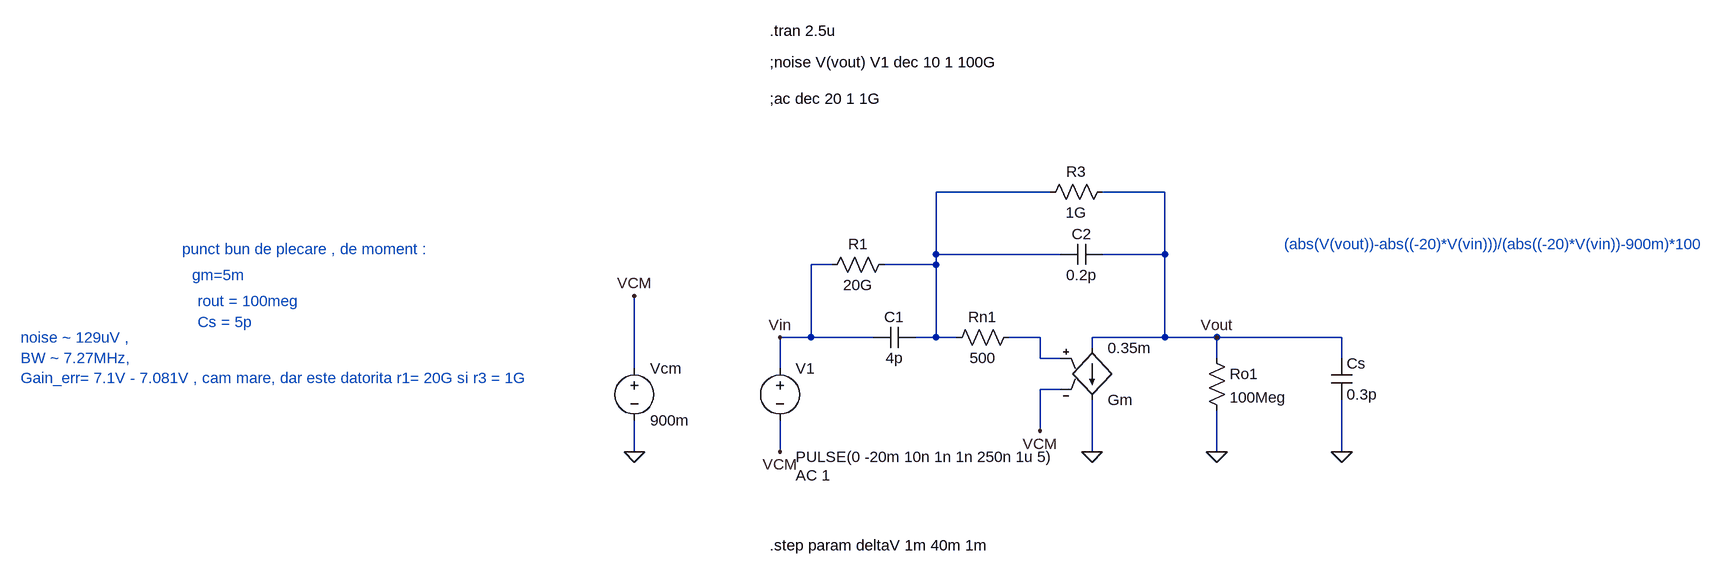
[diagram p0: schematic ota_model.asc]
ota_model.asc, the LTspice schematic file:
Version 4
SHEET 1 1636 680
WIRE 512 -144 336 -144
WIRE 688 -144 592 -144
WIRE 336 -48 336 -144
WIRE 528 -48 336 -48
WIRE 688 -48 688 -144
WIRE 688 -48 592 -48
WIRE 176 -32 144 -32
WIRE 336 -32 336 -48
WIRE 336 -32 256 -32
WIRE 144 80 144 -32
WIRE 144 80 96 80
WIRE 240 80 144 80
WIRE 336 80 336 -32
WIRE 336 80 304 80
WIRE 368 80 336 80
WIRE 496 80 448 80
WIRE 688 80 688 -48
WIRE 688 80 576 80
WIRE 768 80 688 80
WIRE 960 80 768 80
WIRE 576 96 576 80
WIRE 496 112 496 80
WIRE 528 112 496 112
WIRE 768 112 768 80
WIRE 960 112 960 80
WIRE -128 128 -128 16
WIRE 96 128 96 80
WIRE 528 160 496 160
WIRE 496 224 496 160
WIRE -128 256 -128 208
WIRE 96 256 96 208
WIRE 576 256 576 176
WIRE 768 256 768 192
WIRE 960 256 960 176
FLAG -128 256 0
FLAG -128 16 VCM
FLAG 576 256 0
FLAG 496 224 VCM
FLAG 96 256 VCM
FLAG 768 256 0
FLAG 768 80 Vout
FLAG 96 80 Vin
FLAG 960 256 0
SYMBOL voltage 96 112 R0
WINDOW 3 24 152 Left 2
WINDOW 123 24 180 Left 2
WINDOW 39 24 208 Left 2
SYMATTR Value PULSE(0 -20m 10n 1n 1n 250n 1u 5)
SYMATTR Value2 AC 1
SYMATTR InstName V1
SYMBOL voltage -128 112 R0
SYMATTR InstName Vcm
SYMATTR Value 900m
SYMBOL cap 304 64 R90
WINDOW 0 0 32 VBottom 2
WINDOW 3 32 32 VTop 2
SYMATTR InstName C1
SYMATTR Value 4p
SYMBOL cap 592 -64 R90
WINDOW 0 0 32 VBottom 2
WINDOW 3 32 32 VTop 2
SYMATTR InstName C2
SYMATTR Value 0.2p
SYMBOL res 464 64 R90
WINDOW 0 0 56 VBottom 2
WINDOW 3 32 56 VTop 2
SYMATTR InstName Rn1
SYMATTR Value 500
SYMBOL g2 576 192 M180
SYMATTR InstName Gm
SYMATTR Value 0.35m
SYMBOL res 752 96 R0
SYMATTR InstName Ro1
SYMATTR Value 100Meg
SYMATTR Value2 noiseless
SYMBOL res 608 -160 R90
WINDOW 0 0 56 VBottom 2
WINDOW 3 32 56 VTop 2
SYMATTR InstName R3
SYMATTR Value 1G
SYMATTR Value2 noiseless
SYMBOL cap 944 112 R0
SYMATTR InstName Cs
SYMATTR Value 0.3p
SYMBOL res 272 -48 R90
WINDOW 0 0 56 VBottom 2
WINDOW 3 32 56 VTop 2
SYMATTR InstName R1
SYMATTR Value 20G
SYMATTR Value2 noiseless
TEXT 80 -288 Left 2 !;ac dec 20 1 1G
TEXT 80 -392 Left 2 !.tran 2.5u
TEXT 80 -344 Left 2 !;noise V(vout) V1 dec 10 1 100G
TEXT -824 -56 Left 2 ;punct bun de plecare , de moment :
TEXT -808 -16 Left 2 ;gm=5m
TEXT -800 24 Left 2 ;rout = 100meg
TEXT -800 56 Left 2 ;Cs = 5p
TEXT -1072 80 Left 2 ;noise ~ 129uV , \nBW ~ 7.27MHz,\nGain_err= 7.1V - 7.081V , cam mare, dar este datorita r1= 20G si r3 = 1G
TEXT 80 400 Left 2 !.step param deltaV 1m 40m 1m
TEXT 872 -64 Left 2 ;(abs(V(vout))-abs((-20)*V(vin)))/(abs((-20)*V(vin))-900m)*100

The netlist it stands for:
* ota_model.asc
V1 Vin VCM PULSE(0 -20m 10n 1n 1n 250n 1u 5) AC 1
Vcm VCM 0 900m
C1 N001 Vin 4p
C2 Vout N001 0.2p
Rn1 N002 N001 500
Gm Vout 0 N002 VCM 0.35m
Ro1 Vout 0 100Meg noiseless
R3 Vout N001 1G noiseless
Cs Vout 0 0.3p
R1 N001 Vin 20G noiseless
;ac dec 20 1 1G
.tran 2.5u
;noise V(vout) V1 dec 10 1 100G
* punct bun de plecare , de moment :
* gm=5m
* rout = 100meg
* Cs = 5p
* noise ~ 129uV ,
* BW ~ 7.27MHz,
* Gain_err= 7.1V - 7.081V , cam mare, dar este datorita r1= 20G si r3 = 1G
.step param deltaV 1m 40m 1m
* (abs(V(vout))-abs((-20)*V(vin)))/(abs((-20)*V(vin))-900m)*100
.backanno
.end

* Results of the author's LTspice run, read from the files saved beside the schematic
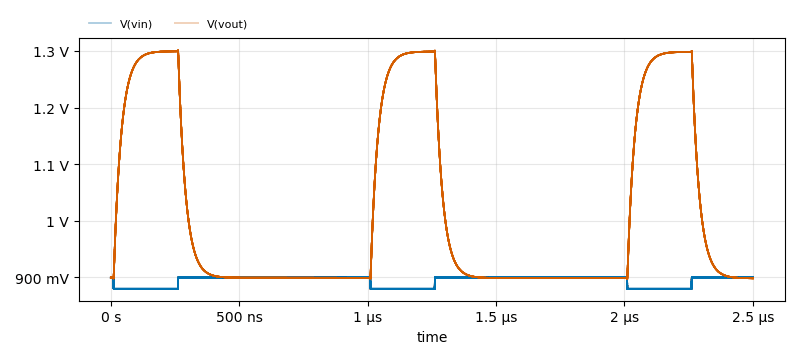
[diagram p1: Transient Analysis of ota_model.asc, plotted from the saved traces]
* Transient Analysis, 40 runs:
*   V(vin) [run 1]: min 880 mV, max 900 mV, average 894 mV, rms 894 mV, last 900 mV
*   V(vin) [run 2]: min 880 mV, max 900 mV, average 894 mV, rms 894 mV, last 900 mV
*   V(vin) [run 3]: min 880 mV, max 900 mV, average 894 mV, rms 894 mV, last 900 mV
*   V(vin) [run 4]: min 880 mV, max 900 mV, average 894 mV, rms 894 mV, last 900 mV
*   V(vin) [run 5]: min 880 mV, max 900 mV, average 894 mV, rms 894 mV, last 900 mV
*   V(vin) [run 6]: min 880 mV, max 900 mV, average 894 mV, rms 894 mV, last 900 mV
*   V(vin) [run 7]: min 880 mV, max 900 mV, average 894 mV, rms 894 mV, last 900 mV
*   V(vin) [run 8]: min 880 mV, max 900 mV, average 894 mV, rms 894 mV, last 900 mV
*   V(vout) [run 1]: min 897.3 mV, max 1.301 V, average 1.02 V, rms 1.033 V, last 898.6 mV
*   V(vout) [run 2]: min 897.3 mV, max 1.301 V, average 1.02 V, rms 1.033 V, last 898.6 mV
*   V(vout) [run 3]: min 897.3 mV, max 1.301 V, average 1.02 V, rms 1.033 V, last 898.6 mV
*   V(vout) [run 4]: min 897.3 mV, max 1.301 V, average 1.02 V, rms 1.033 V, last 898.6 mV
*   V(vout) [run 5]: min 897.3 mV, max 1.301 V, average 1.02 V, rms 1.033 V, last 898.6 mV
*   V(vout) [run 6]: min 897.3 mV, max 1.301 V, average 1.02 V, rms 1.033 V, last 898.6 mV
*   V(vout) [run 7]: min 897.3 mV, max 1.301 V, average 1.02 V, rms 1.033 V, last 898.6 mV
*   V(vout) [run 8]: min 897.3 mV, max 1.301 V, average 1.02 V, rms 1.033 V, last 898.6 mV